# Altium project uMote.PrjPCB
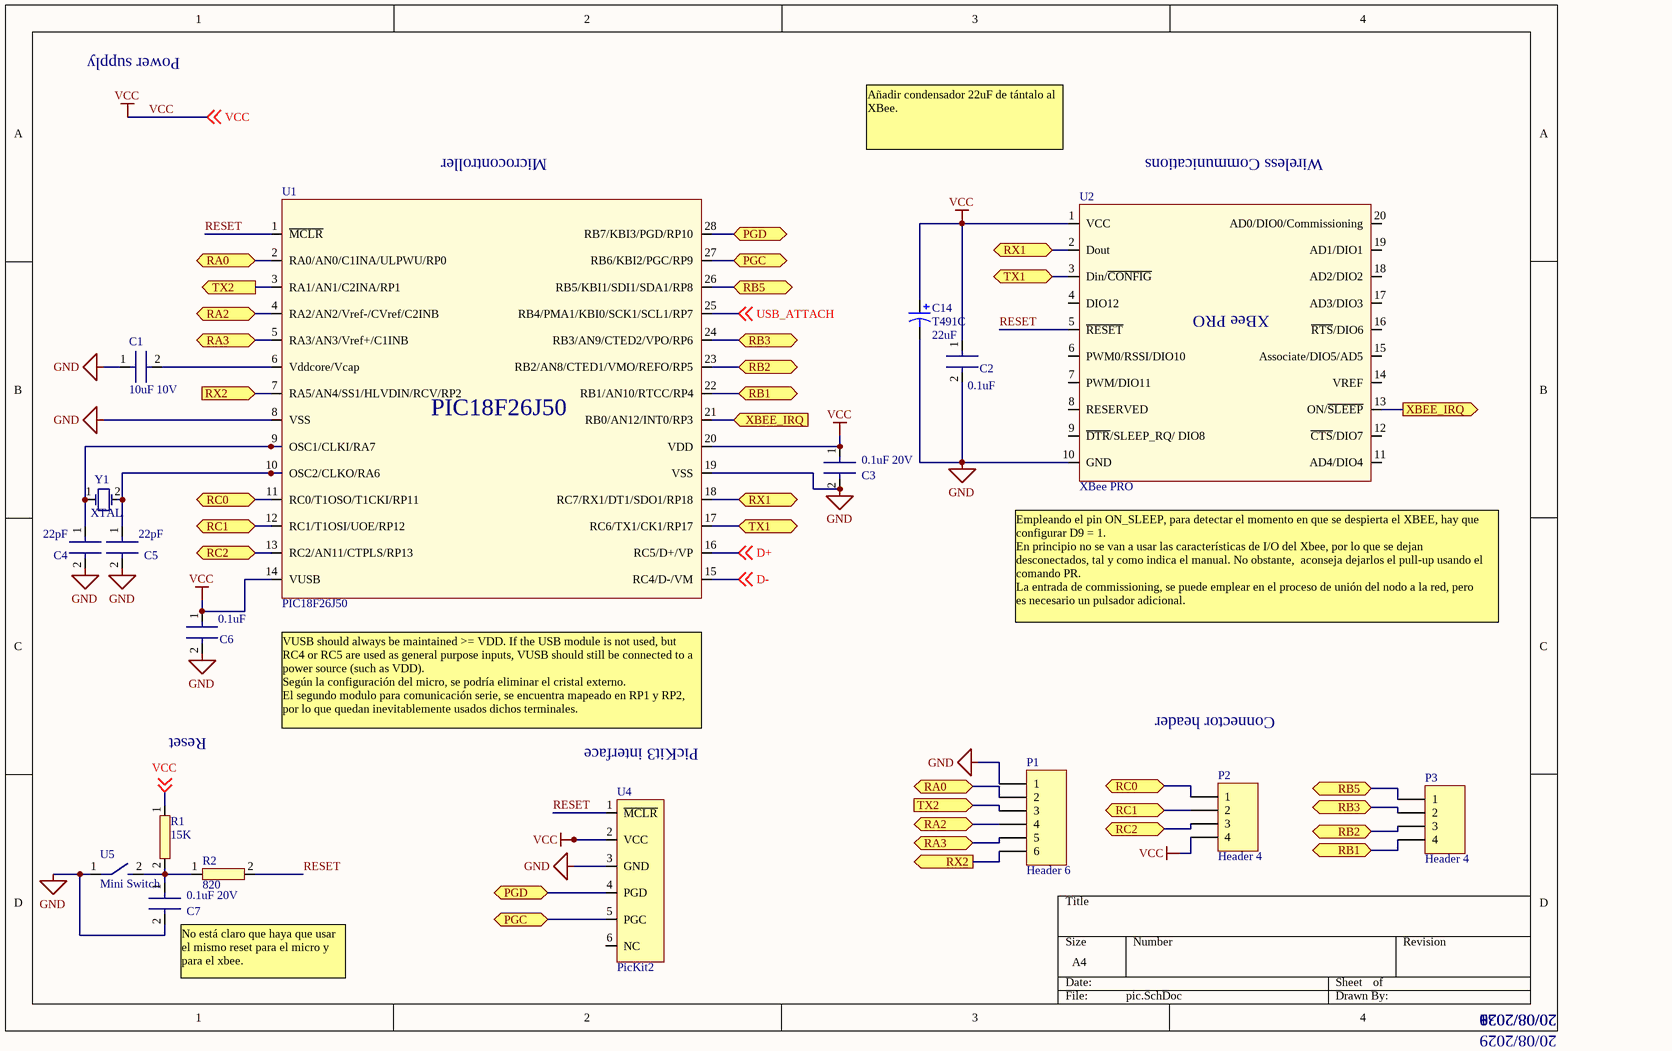
[diagram p0: pic.SchDoc]
2 sheets, 28 parts. Net scope: flat (ports and power ports of the same name join across sheets).
Board file: uMote.PcbDoc
Sheets:
  pic.SchDoc
  power.SchDoc

## Sheet pic.SchDoc
size A4; SheetNumber: 1; SheetTotal: 2

### Parts
C1  10uF 10V  [C1206]
C2  0.1uF  [C1206]
C3  0.1uF 20V  [C1206]
C4  22pF  [C0805]
C5  22pF  [C0805]
C6  0.1uF  [C1206]
C7  0.1uF 20V  [C1206]
C14  T491C  value 22uF  [C]
P1  Header 6  [HDR1X6]
P2  Header 4  [HDR1X4]
P3  Header 4  [HDR1X4]
R1  15K  [3216[1206]]
R2  820  [3216[1206]]
U1  PIC18F26J50  [PIC18F-SOIC]
U2  XBee PRO  [XBee PRO]
U4  PicKit2  [PICKIT3]
U5  Mini Switch  [Mini Switch]
Y1  XTAL  [HC-49/US]

### Ports
PGC, PGD, RA0 (bidir), RA2 (bidir), RA3 (bidir), RB1 (bidir), RB2 (bidir), RB3 (bidir), RB5 (bidir), RC0 (bidir), RC1 (bidir), RC2 (bidir), RX1, RX2 (in), RX2 (out), TX1, TX2 (in), TX2 (out), XBEE_IRQ (in), XBEE_IRQ (out)

### Nets
GND: C1.1 C2.2 C3.2 C4.2 C5.2 C6.2 C7.2 C14.2 P1.1 U1.8(VSS) U1.19(VSS) U2.10(GND) U4.3(GND) U5.1
VCC: C2.1 C3.1 C6.1 C14.1 P2.4 R1.1 U1.14(VUSB) U1.20(VDD) U2.1(VCC) U4.2(VCC) ; off-sheet VCC
D+: U1.16(RC5/D+/VP) ; off-sheet D+
D-: U1.15(RC4/D-/VM) ; off-sheet D-
RESET: R2.2 U1.1(~{MCLR}) U2.5(~{RESET}) U4.1(~{MCLR})
USB_ATTACH: U1.25(RB4/PMA1/KBI0/SCK1/SCL1/RP7) ; off-sheet USB_ATTACH
NetC1_2: C1.2 U1.6(Vddcore/Vcap)
NetC4_1: C4.1 U1.9(OSC1/CLKI/RA7) Y1.1(+)
NetC5_1: C5.1 U1.10(OSC2/CLKO/RA6) Y1.2(-)
NetC7_1: C7.1 R1.2 R2.1 U5.2
NetP1_2: P1.2 U1.2(RA0/AN0/C1INA/ULPWU/RP0) ; port RA0
NetP1_3: P1.3 U1.3(RA1/AN1/C2INA/RP1) ; port TX2
NetP1_4: P1.4 U1.4(RA2/AN2/Vref-/CVref/C2INB) ; port RA2
NetP1_5: P1.5 U1.5(RA3/AN3/Vref+/C1INB) ; port RA3
NetP1_6: P1.6 U1.7(RA5/AN4/SS1/HLVDIN/RCV/RP2) ; port RX2
NetP2_1: P2.1 U1.11(RC0/T1OSO/T1CKI/RP11) ; port RC0
NetP2_2: P2.2 U1.12(RC1/T1OSI/UOE/RP12) ; port RC1
NetP2_3: P2.3 U1.13(RC2/AN11/CTPLS/RP13) ; port RC2
NetP3_1: P3.1 U1.26(RB5/KBI1/SDI1/SDA1/RP8) ; port RB5
NetP3_2: P3.2 U1.24(RB3/AN9/CTED2/VPO/RP6) ; port RB3
NetP3_3: P3.3 U1.23(RB2/AN8/CTED1/VMO/REFO/RP5) ; port RB2
NetP3_4: P3.4 U1.22(RB1/AN10/RTCC/RP4) ; port RB1
NetU1_17: U1.17(RC6/TX1/CK1/RP17) U2.3(Din/~{CONFIG}) ; port TX1
NetU1_18: U1.18(RC7/RX1/DT1/SDO1/RP18) U2.2(Dout) ; port RX1
NetU1_21: U1.21(RB0/AN12/INT0/RP3) U2.13(ON/~{SLEEP}) ; port XBEE_IRQ
NetU1_27: U1.27(RB6/KBI2/PGC/RP9) U4.5(PGC) ; port PGC
NetU1_28: U1.28(RB7/KBI3/PGD/RP10) U4.4(PGD) ; port PGD

Not connected (* = marked no-connect by the designer): U2 4(DIO12) 6(PWM0/RSSI/DIO10) 7(PWM/DIO11) 8(RESERVED) 9(~{DTR}/SLEEP_RQ/_DIO8) 11(AD4/DIO4) 12(~{CTS}/DIO7) 14(VREF) 15(Associate/DIO5/AD5) 16(~{RTS}/DIO6) 17(AD3/DIO3) 18(AD2/DIO2) 19(AD1/DIO1) 20(AD0/DIO0/Commissioning); U4 6(NC)

### Notes on the sheet
- Power supply
- Microcontroller
- Añadir condensador 22uF de tántalo al XBee.
- (near U2) Wireless Communications
- (near U2) Empleando el pin ON_SLEEP, para detectar el momento en que se despierta el XBEE, hay que configurar D9 = 1.
  En principio no se van a usar las características de I/O del Xbee, por lo que se dejan desconectados, tal y como indica el manual. No obstante,  aconseja dejarlos el pull-up usando el comando PR.
  La entrada de commissioning, se puede emplear en el proceso de unión del nodo a la red, pero
  es necesario un pulsador adicional.
- Connector header
- Reset
- VUSB should always be maintained >= VDD. If the USB module is not used, but RC4 or RC5 are used as general purpose inputs, VUSB should still be connected to a power source (such as VDD).
  Según la configuración del micro, se podría eliminar el cristal externo.
  El segundo modulo para comunicación serie, se encuentra mapeado en RP1 y RP2, por lo que quedan inevitablemente usados dichos terminales.
- (near U4) PicKit3 interface
- (near C7) No está claro que haya que usar el mismo reset para el micro y para el xbee.
- 20/08/2028
- 20/08/2029
- 20/08/2030
- 20/08/2031

### Library data of the parts
C1-C7 = TDK C3216X7R1C106K
  C2: Value: 0.1uF
C14 = T491C: Solid Tantalum Chip Capacitor, Standard T491 Series - Industrial Grade; Published: 17-Jul-2002; LatestRevisionDate: 19-Mar-2004; LatestRevisionNote: Silkscreen dimensions re-sized.; DatasheetDocument: Mar-2001; PackageDocument: Mar-2001; PackageReference: C; Publisher: Altium Limited; Code_JEITA: 6032-28; ComponentLink1Description: Manufacturer Link; ComponentLink1URL: http://www.kemet.com/; ComponentLink2Description: Datasheet; ComponentLink2URL: http://www.kemet.com/kemet/web/homepage/kechome.nsf/vapubfilesname/F3102TA.pdf/$file/F3102TA.pdf
P1 = Header 6: Header, 6-Pin; LatestRevisionDate: 17-Jul-2002; LatestRevisionNote: Re-released for DXP Platform.; Publisher: Altium Limited
P2 P3 = Header 4: Header, 4-Pin; LatestRevisionDate: 17-Jul-2002; LatestRevisionNote: Re-released for DXP Platform.; Publisher: Altium Limited
R1 R2 = RES 1206

## Sheet power.SchDoc
size A4; SheetNumber: 2; SheetTotal: 2
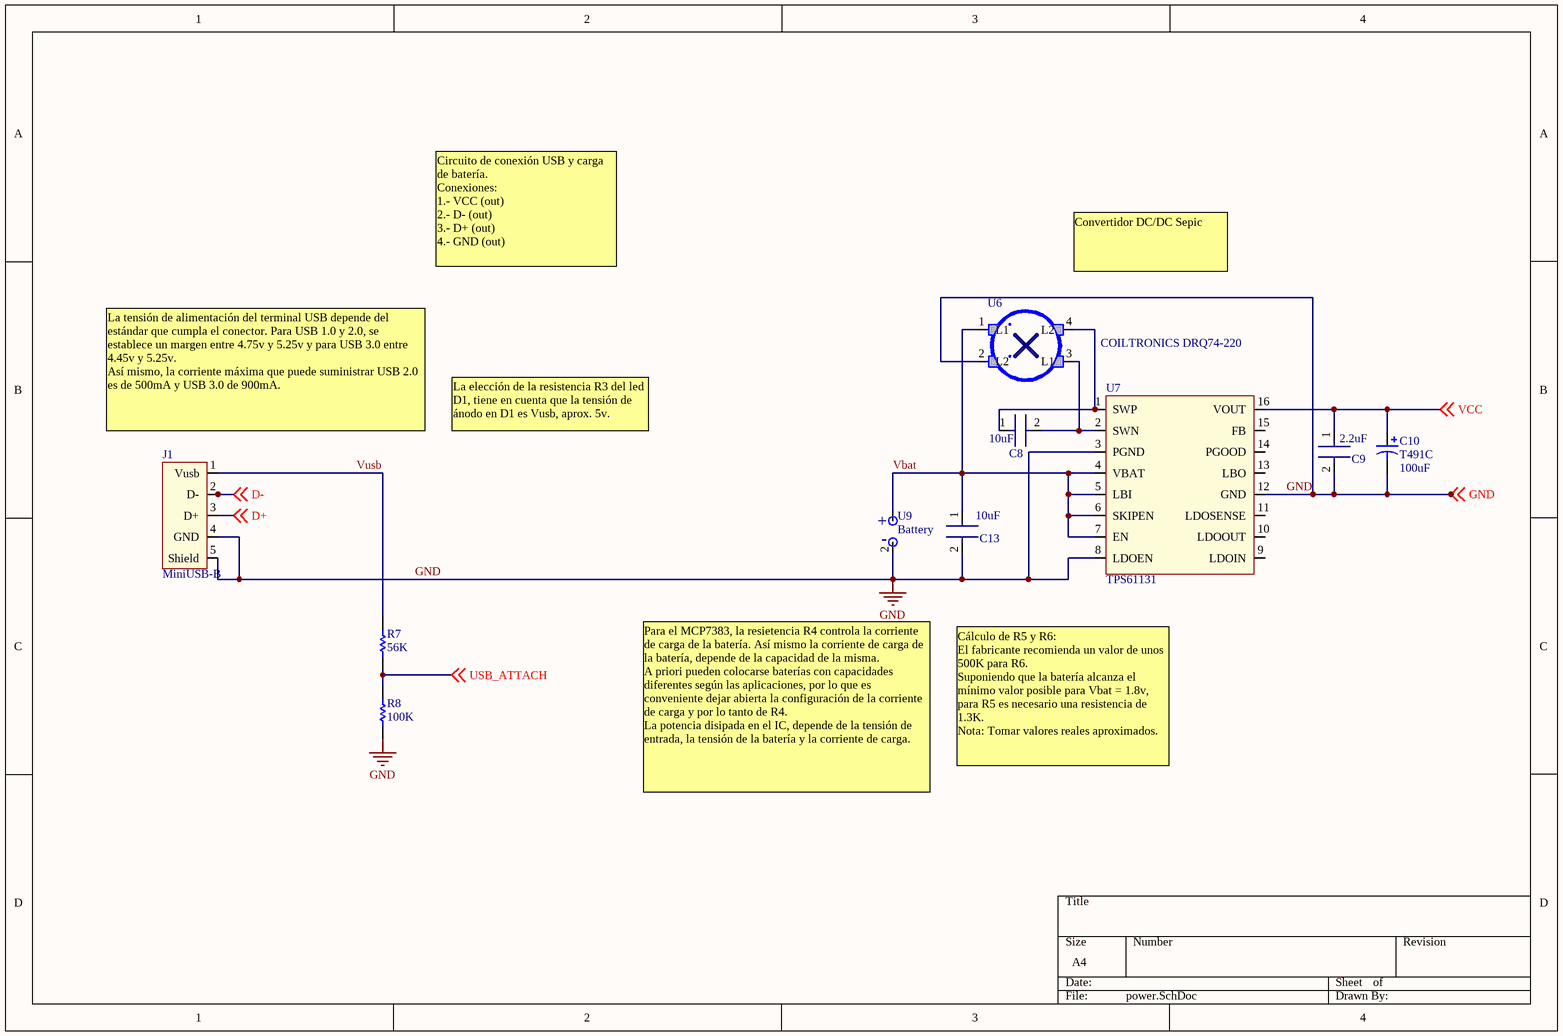
[diagram p1: power.SchDoc]

### Parts
C8  10uF  [C1206]
C9  2.2uF  [C1206]
C10  T491C  value 100uF  [C]
C13  10uF  [C1206]
J1  MiniUSB-B  [MINI USB]
R7  56K  [3216[1206]]
R8  100K  [3216[1206]]
U6  COILTRONICS DRQ74-220  [Trafo Flyback-SEPIC - soldadura manual]
U7  TPS61131  [TPS61131]
U9  Battery  [JST PH]

### Nets
GND: C9.2 C10.2 C13.2 J1.4(GND) J1.5(Shield) R8.1 U6.2(L2) U7.3(PGND) U7.8(LDOEN) U7.12(GND) U9.2 ; off-sheet GND
VCC: C9.1 C10.1 U7.16(VOUT) ; off-sheet VCC
D+: J1.3(D+) ; off-sheet D+
D-: J1.2(D-) ; off-sheet D-
USB_ATTACH: R7.1 R8.2 ; off-sheet USB_ATTACH
Vbat: C13.1 U6.1(L1) U7.4(VBAT) U7.5(LBI) U7.6(SKIPEN) U7.7(EN) U9.1
Vusb: J1.1(Vusb) R7.2
NetC8_1: C8.1 U6.4(L2) U7.1(SWP)
NetC8_2: C8.2 U6.3(L1) U7.2(SWN)

Not connected (* = marked no-connect by the designer): U7 9(LDOIN) 10(LDOOUT) 11(LDOSENSE) 13(LBO) 14(PGOOD) 15(FB)

### Notes on the sheet
- Circuito de conexión USB y carga de batería.
  Conexiones:
  1.- VCC (out)
  2.- D- (out)
  3.- D+ (out)
  4.- GND (out)
- Convertidor DC/DC Sepic
- (near J1) La tensión de alimentación del terminal USB depende del estándar que cumpla el conector. Para USB 1.0 y 2.0, se establece un margen entre 4.75v y 5.25v y para USB 3.0 entre 4.45v y 5.25v.
  Así mismo, la corriente máxima que puede suministrar USB 2.0 es de 500mA y USB 3.0 de 900mA.
- La elección de la resistencia R3 del led D1, tiene en cuenta que la tensión de ánodo en D1 es Vusb, aprox. 5v.
- Para el MCP7383, la resietencia R4 controla la corriente de carga de la batería. Así mismo la corriente de carga de la batería, depende de la capacidad de la misma.
  A priori pueden colocarse baterías con capacidades diferentes según las aplicaciones, por lo que es conveniente dejar abierta la configuración de la corriente de carga y por lo tanto de R4.
  La potencia disipada en el IC, depende de la tensión de entrada, la tensión de la batería y la corriente de carga.
- Cálculo de R5 y R6:
  El fabricante recomienda un valor de unos 500K para R6.
  Suponiendo que la batería alcanza el mínimo valor posible para Vbat = 1.8v,
  para R5 es necesario una resistencia de 1.3K.
  Nota: Tomar valores reales aproximados.
- (in symbol Battery) +; -

### Library data of the parts
C8 C9 = TDK C3216X7R1C106K
C10 = T491C: as C14 on sheet pic; Published: 17-Jul-2002; LatestRevisionDate: 19-Mar-2004; LatestRevisionNote: Silkscreen dimensions re-sized.; DatasheetDocument: Mar-2001; PackageDocument: Mar-2001; PackageReference: C; Publisher: Altium Limited; Code_JEITA: 6032-28; ComponentLink1Description: Manufacturer Link; ComponentLink1URL: http://www.kemet.com/; ComponentLink2Description: Datasheet; ComponentLink2URL: http://www.kemet.com/kemet/web/homepage/kechome.nsf/vapubfilesname/F3102TA.pdf/$file/F3102TA.pdf
C13 = TDK C3216X7R1C106K: 4.7uF
R7 R8 = Res Semi: Semiconductor Resistor; Value: 1K; Published: 8-Jun-2000; LatestRevisionDate: 17-Jul-2002; LatestRevisionNote: Re-released for DXP Platform.; PackageReference: AXIAL-0.5; Publisher: Altium Limited; PackageDescription: Axial Device, Thru-Hole; 2 Leads; 0.5 in Pin Spacing

## Nets that join several sheets
GND: pic (14 pins), power (11 pins)
VCC: pic (10 pins), power (C9.1 C10.1 U7.16)
D+: pic (U1.16), power (J1.3)
D-: pic (U1.15), power (J1.2)
USB_ATTACH: pic (U1.25), power (R7.1 R8.2)